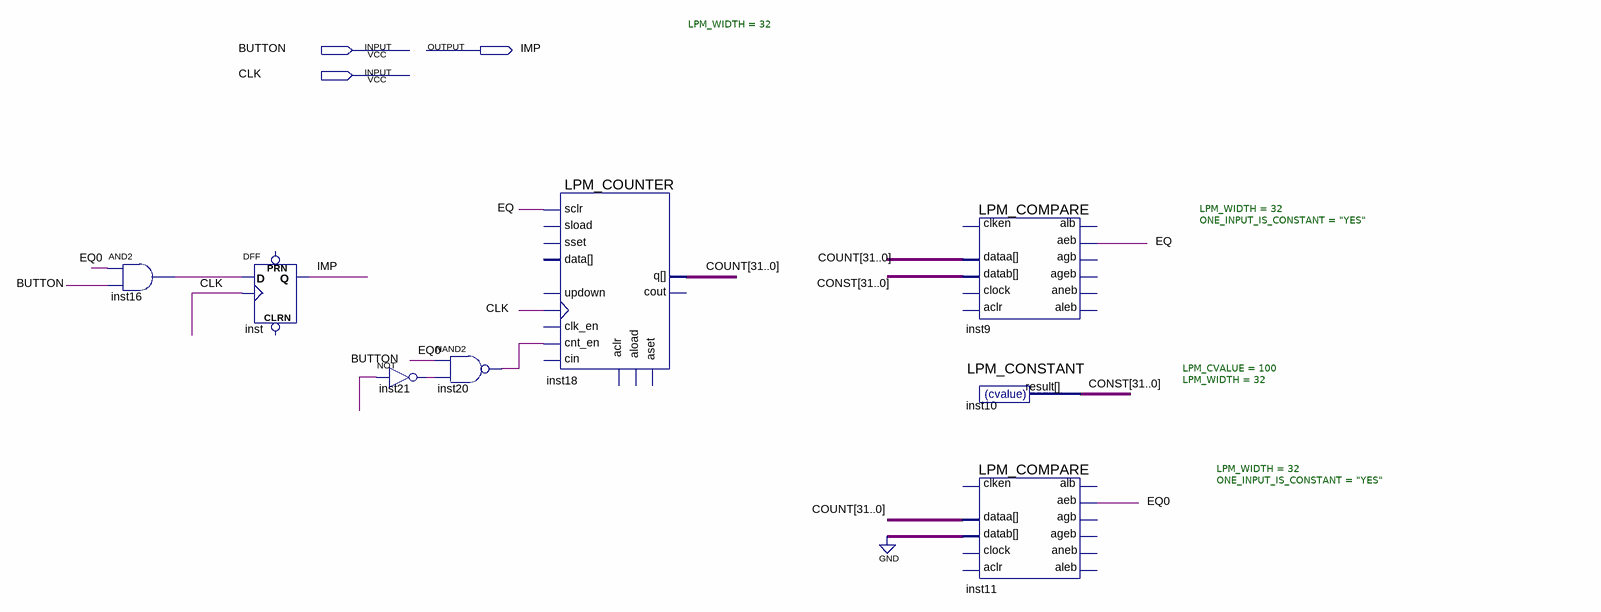
[diagram p0: schematic sheet]
// Quartus schematic g27_debounce2mill.bdf as structural Verilog: 8 symbols, 3 pins
module g27_debounce2mill (
  input  BUTTON,
  input  CLK,
  output IMP
);

  wire EQ, EQ0, inst16_out, inst20_out, inst21_out;
  wire [31:0] CONST, COUNT;

  and inst16 (inst16_out, EQ0, BUTTON);
  DFF inst (.CLK(CLK), .D(inst16_out), .Q(IMP));  // open: CLRN, PRN
  not inst21 (inst21_out, BUTTON);
  nand inst20 (inst20_out, EQ0, inst21_out);
  LPM_COUNTER #(.LPM_WIDTH(32)) inst18 (
    .clock(CLK), .cnt_en(inst20_out), .sclr(EQ), .q(COUNT));  // open: sload, data, clk_en, aload, aclr, aset, cin, sset, updown, cout
  LPM_COMPARE #(.LPM_WIDTH(32), .ONE_INPUT_IS_CONSTANT("YES")) inst9 (
    .dataa(COUNT), .datab(CONST), .aeb(EQ));  // open: clock, aclr, clken, aleb, agb, aneb, ageb, alb
  LPM_CONSTANT #(.LPM_CVALUE(100), .LPM_WIDTH(32)) inst10 (.result(CONST));
  LPM_COMPARE #(.LPM_WIDTH(32), .ONE_INPUT_IS_CONSTANT("YES")) inst11 (
    .dataa(COUNT), .datab({32{1'b0}}), .aeb(EQ0));  // open: clock, aclr, clken, aleb, agb, aneb, ageb, alb
endmodule
